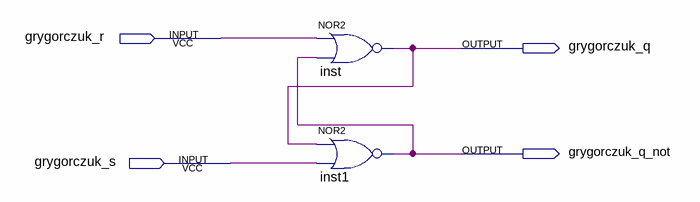
[diagram p0: schematic sheet]
// Quartus schematic SR_LATCH.bdf as structural Verilog: 2 symbols, 4 pins
module SR_LATCH (
  input  grygorczuk_r,
  input  grygorczuk_s,
  output grygorczuk_q,
  output grygorczuk_q_not
);

  nor inst (grygorczuk_q, grygorczuk_r, grygorczuk_q_not);
  nor inst1 (grygorczuk_q_not, grygorczuk_q, grygorczuk_s);
endmodule
